# EAGLE schematic AutomaticNightLightv3 (EAGLE 9.4.2)
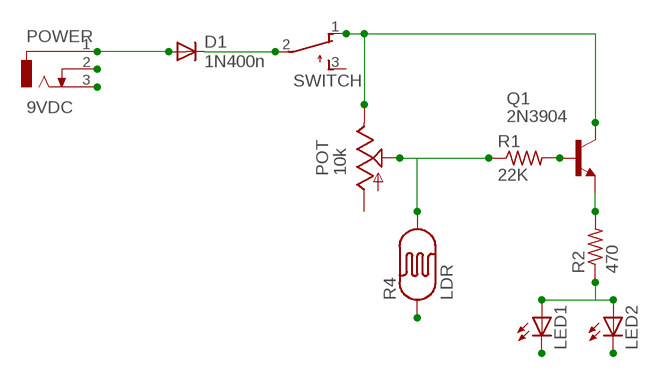
[diagram p0: schematic, sheet 1]

## Parts
D1  1N400n  1N4004  [DO41-10]
LED1  LED5MM  [LED5MM]
LED2  LED5MM  [LED5MM]
POT  10k  TRIM_US-S64W  [S64W]
POWER  9VDC  DC_JACK/PJ-202AH  [PJ-202AH]
Q1  2N3904  2N2222  [TO92-EBC-OVAL]
R1  22K  RESISTOR  [0207/10]
R2  470  RESISTOR  [0207/10]
R4  LDR  PHOTOCELLPTH  [PHOTOCELL]
SWITCH  TL32PO  [TL3XPO]

## Nets
GND: LED1.K(C) LED2.K(C) POWER.2 POWER.3 R4.1
N$1: D1.A POWER.1
N$2: D1.C SWITCH.2(P)
N$5: Q1.B R1.2
N$6: Q1.E R2.2
N$7: POT.S R1.1 R4.2
N$8: POT.E Q1.C SWITCH.1(O)
N$9: LED1.A LED2.A R2.1
Unconnected: POT.A SWITCH.3(S)

## Library data of the parts
D1 = adafruit:1N4004: DIODE General purpose 1N400x type rectifier (With bigger pads) http://www.ladyada.net/library/pcb/eaglelibrary.html
LED1 LED2 = led:LED: LED OSRAM: - CHIPLED LG R971, LG N971, LY N971, LG Q971, LY Q971, LO R971, LY R971 LH N974, LH R974 LS Q976, LO Q976, LY Q976 LO Q996 - Hyper CHIPLED LW Q18S LB Q993, LB Q99A, LB R99A - SideLED LS A670, LO A670, LY A670, LG A670, LP A670 LB A673, LV A673, LT A673, LW A673 LH A674 LY A675 LS A676, LA A676, LO A676, LY A676, LW A676 LS A679, LY A679, LG A679 - Hyper Micro SIDELED® LS Y876, LA Y876, LO Y876, LY Y876 LT Y87S - SmartLED LW L88C, LW L88S LB L89C, LB L89S, LG L890 LS L89K, LO L89K, LY L89K LS L896, LA L896, LO L896, LY L896 - TOPLED LS T670, LO T670, LY T670, LG T670, LP T670 LSG T670, LSP T670, LSY T670, LOP T670, LYG T670 LG T671, LOG T671, LSG T671 LB T673, LV T673, LT T673, LW T673 LH T674 LS T676, LA T676, LO T676, LY T676, LB T676, LH T676, LSB T676, LW T676 LB T67C, LV T67C, LT T67C, LS T67K, LO T67K, LY T67K, LW E67C LS E67B, LA E67B, LO E67B, LY E67B, LB E67C, LV E67C, LT E67C LW T67C LS T679, LY T679, LG T679 LS T770, LO T770, LY T770, LG T770, LP T770 LB T773, LV T773, LT T773, LW T773 LH T774 LS E675, LA E675, LY E675, LS T675 LS T776, LA T776, LO T776, LY T776, LB T776 LHGB T686 LT T68C, LB T68C - Hyper Mini TOPLED® LB M676 - Mini TOPLED Santana® LG M470 LS M47K, LO M47K, LY M47K Source: http://www.osram.convergy.de LUXEON: - LUMILED® LXK2-PW12-R00, LXK2-PW12-S00, LXK2-PW14-U00, LXK2-PW14-V00 LXK2-PM12-R00, LXK2-PM12-S00, LXK2-PM14-U00 LXK2-PE12-Q00, LXK2-PE12-R00, LXK2-PE12-S00, LXK2-PE14-T00, LXK2-PE14-U00 LXK2-PB12-K00, LXK2-PB12-L00, LXK2-PB12-M00, LXK2-PB14-N00, LXK2-PB14-P00, LXK2-PB14-Q00 LXK2-PR12-L00, LXK2-PR12-M00, LXK2-PR14-Q00, LXK2-PR14-R00 LXK2-PD12-Q00, LXK2-PD12-R00, LXK2-PD12-S00 LXK2-PH12-R00, LXK2-PH12-S00 LXK2-PL12-P00, LXK2-PL12-Q00, LXK2-PL12-R00 Source: www.luxeon.com KINGBRIGHT: KA-3528ASYC Source: www.kingbright.com
POT = pot:TRIM_US-: POTENTIOMETER
POWER = ACES_THT:DC_JACK: Through hole pins are either tapered pins (PJ-102A) or eyelet (straight or kinked) PJ-202AH.
Q1 = adafruit:2N2222: NPN TRANSISTOR Big oval pads
R1 R2 = ACES_THT:RESISTOR: Based on rcl Libray part R-US_0207/10 with longer oval pads for easier hand soldering. Digikey Part #: 470QBK-ND <https://www.digikey.ca/products/en/resistors/through-hole-resistors/53?k=fixed+resistor&k=&pkeyword=fixed+resistor&sv=1&pv2=4&pv174=18&sf=0&FV=ffe00035%2Cfffc000d%2C1c0003%2C1f140000%2Cmu470+Ohms%7C2085&quantity=&ColumnSort=0&page=1&stock=1&pageSize=25>
R4 = SparkFun-Sensors:PHOTOCELL: CdS photoresistor. This is a low cost way to detect light levels. Resistance decreases with more incoming light. SparkFun SKU: SEN-09088
SWITCH = switch:TL32PO: TINY SWITCH ON - MOM Source: http://www2.produktinfo.conrad.com/datenblaetter/700000-724999/705152-da-01-de-Subminiaturschalter_TL_36YO.pdf